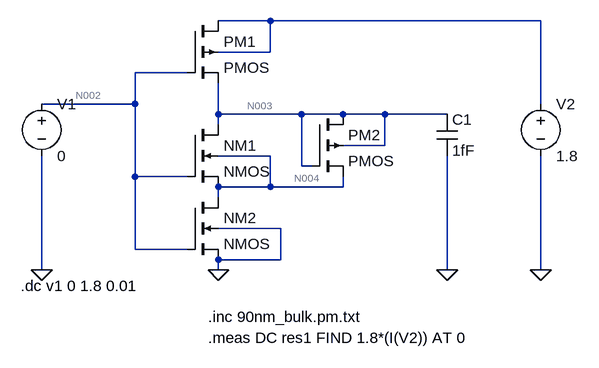
[diagram p0: schematic staticpowerproposed@0.asc]
staticpowerproposed@0.asc, the LTspice schematic file:
Version 4
SHEET 1 880 680
WIRE 304 32 224 32
WIRE 720 32 304 32
WIRE 304 80 304 32
WIRE 304 80 224 80
WIRE 176 112 96 112
WIRE 96 160 96 112
WIRE 96 160 -48 160
WIRE 720 160 720 32
WIRE 224 176 224 128
WIRE 352 176 224 176
WIRE 416 176 352 176
WIRE 480 176 416 176
WIRE 576 176 480 176
WIRE 224 192 224 176
WIRE 480 224 480 176
WIRE 480 224 416 224
WIRE 304 240 224 240
WIRE 352 256 352 176
WIRE 368 256 352 256
WIRE 96 272 96 160
WIRE 176 272 96 272
WIRE 304 288 304 240
WIRE 304 288 224 288
WIRE 416 288 416 272
WIRE 416 288 304 288
WIRE 224 304 224 288
WIRE 320 352 224 352
WIRE 96 384 96 272
WIRE 176 384 96 384
WIRE 320 400 320 352
WIRE 320 400 224 400
WIRE -48 416 -48 240
WIRE 224 416 224 400
WIRE 576 416 576 240
WIRE 720 416 720 240
FLAG -48 416 0
FLAG 224 416 0
FLAG 576 416 0
FLAG 720 416 0
SYMBOL nmos4 176 304 R0
SYMATTR InstName NM2
SYMATTR Value2 l=100n w=45n
SYMBOL nmos4 176 192 R0
SYMATTR InstName NM1
SYMATTR Value2 l=100n w=45n
SYMBOL pmos4 176 32 R0
SYMATTR InstName PM1
SYMATTR Value2 l=100n w=75n
SYMBOL pmos4 368 176 R0
SYMATTR InstName PM2
SYMATTR Value2 l=100n w=75n
SYMBOL voltage -48 144 R0
SYMATTR InstName V1
SYMATTR Value 0
SYMBOL voltage 720 144 R0
SYMATTR InstName V2
SYMATTR Value 1.8
SYMBOL cap 560 176 R0
SYMATTR InstName C1
SYMATTR Value 1fF
TEXT -80 440 Left 2 !.dc v1 0 1.8 0.01
TEXT 208 488 Left 2 !.inc 90nm_bulk.pm.txt
TEXT 208 520 Left 2 !.meas DC res1 FIND 1.8*(I(V2)) AT 0

The netlist it stands for:
* staticpowerproposed@0.asc
M§NM2 N004 N002 0 0 NMOS l=100n w=45n
M§NM1 N003 N002 N004 N004 NMOS l=100n w=45n
M§PM1 N001 N002 N003 N001 PMOS l=100n w=75n
M§PM2 N003 N003 N004 N003 PMOS l=100n w=75n
V1 N002 0 0
V2 N001 0 1.8
C1 N003 0 1fF
.model NMOS NMOS
.model PMOS PMOS
.lib standard.mos
.dc v1 0 1.8 0.01
.inc 90nm_bulk.pm.txt
.meas DC res1 FIND 1.8*(I(V2)) AT 0
.backanno
.end

* Results of the author's LTspice run, read from the files saved beside the schematic
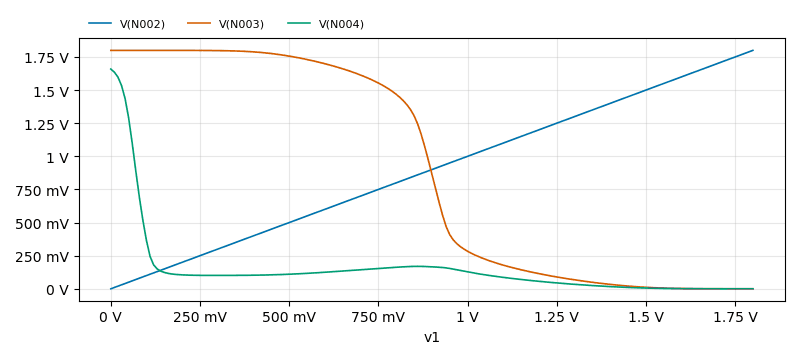
[diagram p1: DC transfer characteristic of staticpowerproposed@0.asc, plotted from the saved traces]
* DC transfer characteristic, 1 run:
*   V(N002): 0 V at v1=0 V, 1.8 V at v1=1.8 V, min 0 V, max 1.8 V
*   V(N003): 1.8 V at v1=0 V, 201 µV at v1=1.8 V, min 189.3 µV, max 1.8 V
*   V(N004): 1.659 V at v1=0 V, 136.2 µV at v1=1.8 V, min 125 µV, max 1.659 V
* From the log:
*   res1: 1.8*(i(v2))=-1.07173e-008 at 0